# EAGLE schematic dorbell (EAGLE 6.3)
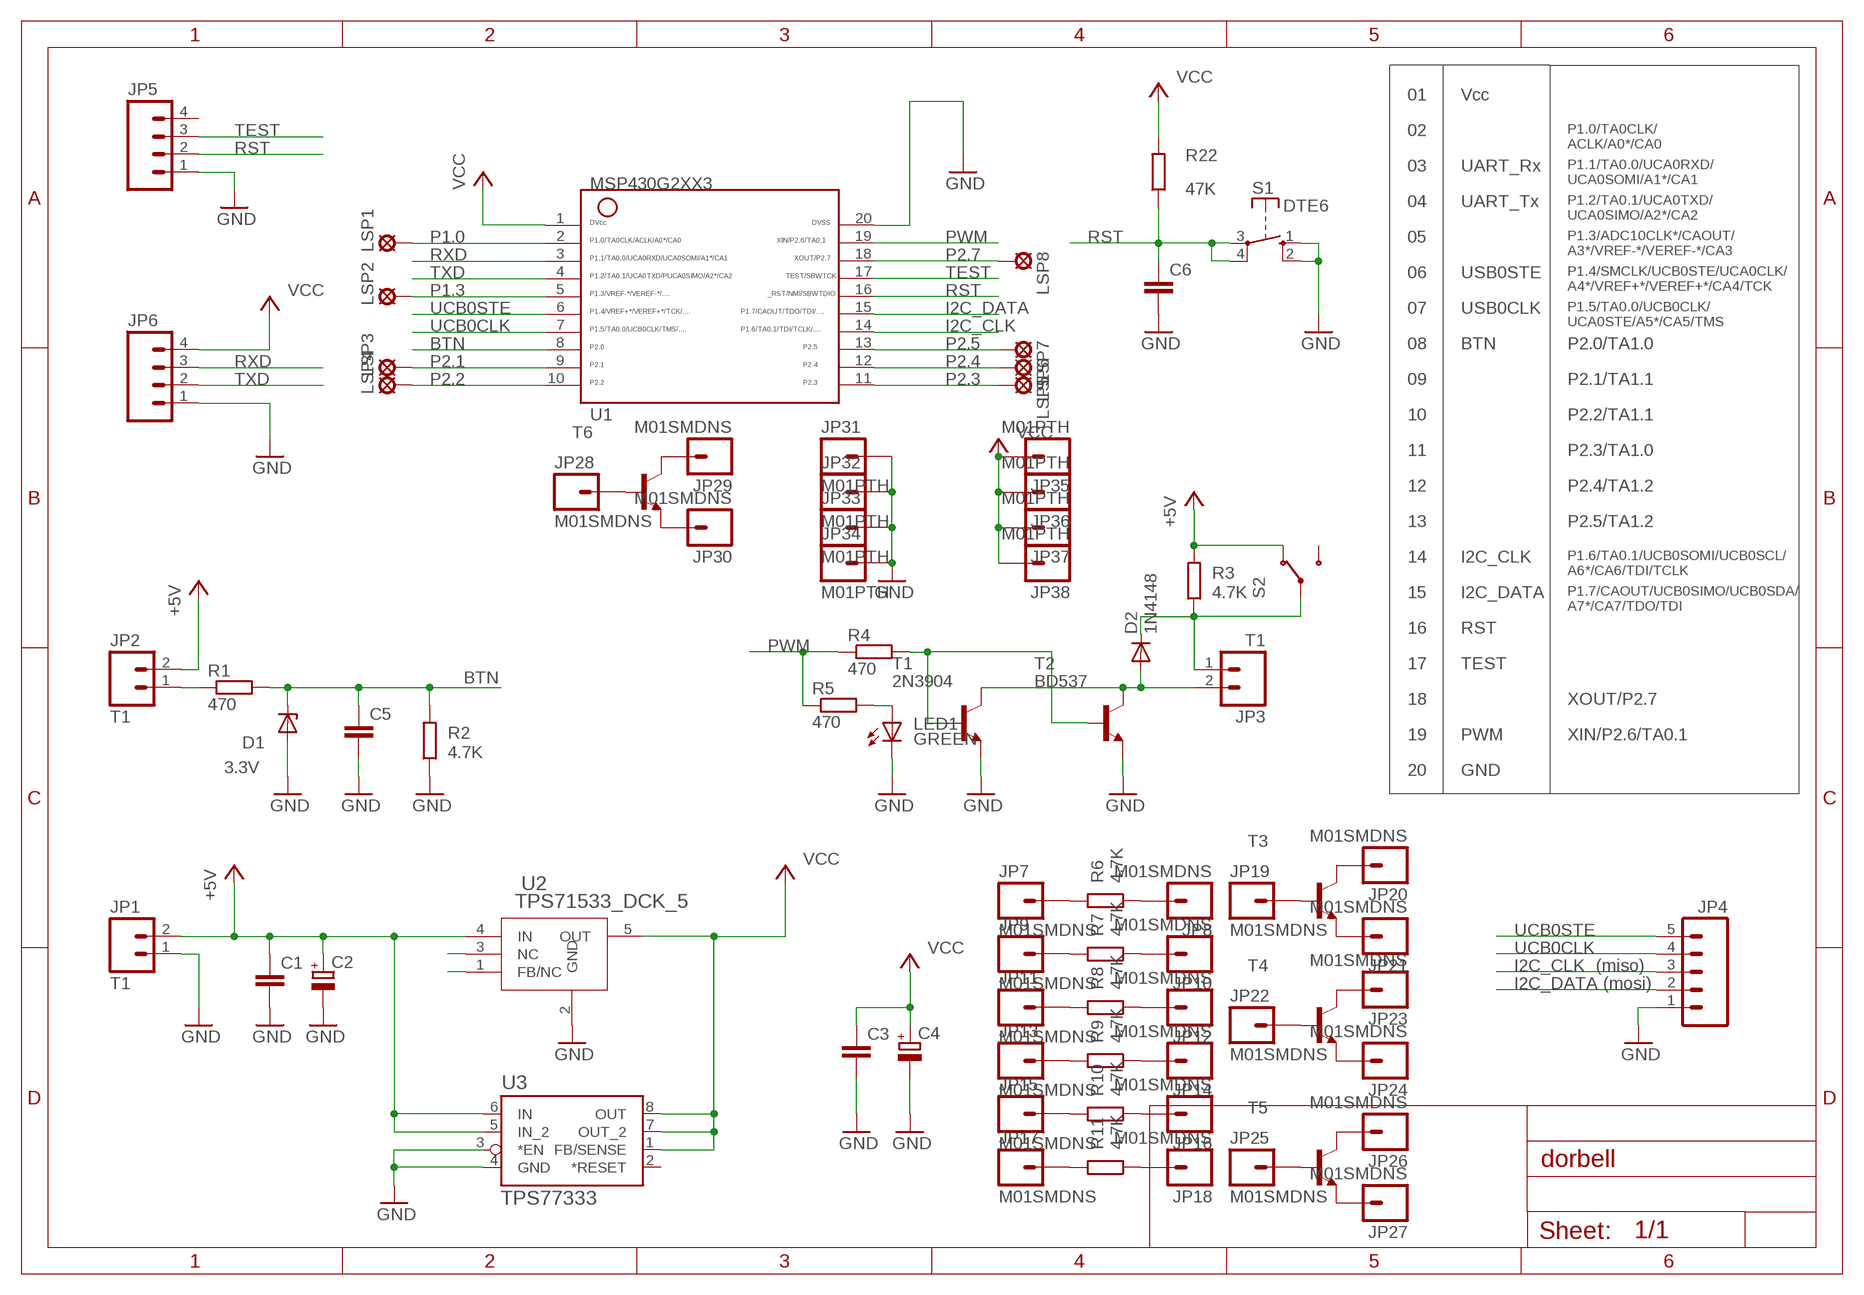
[diagram p0: schematic, sheet 1]

## Parts
C1  C-EUC0805  [C0805]
C2  CPOL-EUE2.5-7  [E2,5-7]
C3  C-EUC0805  [C0805]
C4  CPOL-EUE2.5-7  [E2,5-7]
C5  C-EUC0805  [C0805]
C6  C-EUC0805  [C0805]
D1  3.3V  ZENER-DIODEZD-2.5  [ZDIO-2.5]
D2  1N4148  DIODE-SOD123  [SOD123]
JP1  T1  M025MM  [SCREWTERMINAL-5MM-2]
JP2  T1  M025MM  [SCREWTERMINAL-5MM-2]
JP3  T1  M025MM  [SCREWTERMINAL-5MM-2]
JP4  M05PTH  [1X05]
JP5  M04PTH  [1X04]
JP6  M04PTH  [1X04]
JP7  M01SMDNS  [1X01NS]
JP8  M01SMDNS  [1X01NS]
JP9  M01SMDNS  [1X01NS]
JP10  M01SMDNS  [1X01NS]
JP11  M01SMDNS  [1X01NS]
JP12  M01SMDNS  [1X01NS]
JP13  M01SMDNS  [1X01NS]
JP14  M01SMDNS  [1X01NS]
JP15  M01SMDNS  [1X01NS]
JP16  M01SMDNS  [1X01NS]
JP17  M01SMDNS  [1X01NS]
JP18  M01SMDNS  [1X01NS]
JP19  M01SMDNS  [1X01NS]
JP20  M01SMDNS  [1X01NS]
JP21  M01SMDNS  [1X01NS]
JP22  M01SMDNS  [1X01NS]
JP23  M01SMDNS  [1X01NS]
JP24  M01SMDNS  [1X01NS]
JP25  M01SMDNS  [1X01NS]
JP26  M01SMDNS  [1X01NS]
JP27  M01SMDNS  [1X01NS]
JP28  M01SMDNS  [1X01NS]
JP29  M01SMDNS  [1X01NS]
JP30  M01SMDNS  [1X01NS]
JP31  M01PTH  [1X01]
JP32  M01PTH  [1X01]
JP33  M01PTH  [1X01]
JP34  M01PTH  [1X01]
JP35  M01PTH  [1X01]
JP36  M01PTH  [1X01]
JP37  M01PTH  [1X01]
JP38  M01PTH  [1X01]
LED1  GREEN  LEDCHIP-LED0805  [CHIP-LED0805]
LSP1  LSP10  [LSP10]
LSP2  LSP10  [LSP10]
LSP3  LSP10  [LSP10]
LSP4  LSP10  [LSP10]
LSP5  LSP10  [LSP10]
LSP6  LSP10  [LSP10]
LSP7  LSP10  [LSP10]
LSP8  LSP10  [LSP10]
R1  470  R-EU_R0805  [R0805]
R2  4.7K  R-EU_R0805  [R0805]
R3  4.7K  R-EU_0207/2V  [0207/2V]
R4  470  R-EU_R0805  [R0805]
R5  470  R-EU_R0805  [R0805]
R6  4.7K  R-EU_R0805  [R0805]
R7  4.7K  R-EU_R0805  [R0805]
R8  4.7K  R-EU_R0805  [R0805]
R9  4.7K  R-EU_R0805  [R0805]
R10  4.7K  R-EU_R0805  [R0805]
R11  4.7K  R-EU_R0805  [R0805]
R22  47K  R-EU_R0805  [R0805]
S1  DTE6  [DTE6]
S2  SWITCH_2DIR  [SWITCH_SLIDE]
T1  2N3904  [TO92]
T2  BD537  -NPN-TO220V  [TO220V]
T3  MMBT3904LT1-NPN-SOT23-BEC  [SOT23-BEC]
T4  MMBT3904LT1-NPN-SOT23-BEC  [SOT23-BEC]
T5  MMBT3904LT1-NPN-SOT23-BEC  [SOT23-BEC]
T6  -NPN-TO92-E1  [TO92-E1]
U1  G2XX3---PW20  [PW20]
U2  TPS71533_DCK_5  [DCK5]
U3  TPS77333  [DGK8]

## Nets
+5V [5V]: C1.1 C2.+ JP1.2 JP2.2 R3.2 S2.P$1 U2.4(IN) U3.5(IN_2) U3.6(IN)
BTN: C5.1 D1.C R1.2 R2.2 U1.8
GND [GND]: C1.2 C2.- C3.2 C4.- C5.2 C6.2 D1.A JP1.1 JP4.1 JP5.1 JP6.1 JP31.1 JP32.1 JP33.1 JP34.1 LED1.C R2.1 S1.1(S) S1.2(S) T1.3(E) T2.3(E) U1.20 U2.2(GND) U3.3(*EN) U3.4(GND)
I2C_CLK: JP4.3 U1.14
I2C_DATA: JP4.2 U1.15
N$1: D2.A JP3.2 T1.1(C) T2.2(C)
N$2: D2.C JP3.1 R3.1 S2.P$2
N$3: R4.2 T1.2(B) T2.1(B)
N$4: JP2.1 R1.1
N$5: LED1.A R5.2
N$8: JP7.1 R6.2
N$9: JP8.1 R6.1
N$10: JP9.1 R7.2
N$11: JP10.1 R7.1
N$12: JP11.1 R8.2
N$13: JP12.1 R8.1
N$14: JP13.1 R9.2
N$15: JP14.1 R9.1
N$16: JP15.1 R10.2
N$17: JP16.1 R10.1
N$18: JP17.1 R11.2
N$19: JP18.1 R11.1
N$20: JP19.1 T3.B
N$21: JP20.1 T3.C
N$22: JP21.1 T3.E
N$23: JP22.1 T4.B
N$24: JP23.1 T4.C
N$25: JP24.1 T4.E
N$26: JP25.1 T5.B
N$27: JP26.1 T5.C
N$28: JP27.1 T5.E
N$29: JP28.1 T6.2(B)
N$30: JP29.1 T6.1(C)
N$31: JP30.1 T6.3(E)
N$32: U2.3(NC)
N$33: U2.1(FB/NC)
P1.0: LSP1.MP U1.2
P1.3: LSP2.MP U1.5
P2.1: LSP3.MP U1.9
P2.2: LSP4.MP U1.10
P2.3: LSP5.MP U1.11
P2.4: LSP6.MP U1.12
P2.5: LSP7.MP U1.13
P2.7: LSP8.MP U1.18
PWM: R4.1 R5.1 U1.19
RST: C6.1 JP5.2 R22.1 S1.3(P) S1.4(P) U1.16
RXD: JP6.3 U1.3
TEST: JP5.3 U1.17
TXD: JP6.2 U1.4
UCB0CLK: JP4.4 U1.7
UCB0STE: JP4.5 U1.6
VCC: C3.1 C4.+ JP6.4 JP35.1 JP36.1 JP37.1 JP38.1 R22.2 U1.1 U2.5(OUT) U3.1(FB/SENSE) U3.7(OUT_2) U3.8(OUT)
Unconnected: JP5.4 S2.P$3 U3.2(*RESET)

## Notes on the sheet
- 01 | Vcc
- 02
- P1.0/TA0CLK/
  ACLK/A0*/CA0
- 03 | UART_Rx
- P1.1/TA0.0/UCA0RXD/
  UCA0SOMI/A1*/CA1
- 04 | UART_Tx
- P1.2/TA0.1/UCA0TXD/
  UCA0SIMO/A2*/CA2
- 05
- P1.3/ADC10CLK*/CAOUT/
  A3*/VREF-*/VEREF-*/CA3
- 06 | USB0STE
- P1.4/SMCLK/UCB0STE/UCA0CLK/
  A4*/VREF+*/VEREF+*/CA4/TCK
- 07 | USB0CLK
- P1.5/TA0.0/UCB0CLK/
  UCA0STE/A5*/CA5/TMS
- 08 | BTN | P2.0/TA1.0
- 09 | P2.1/TA1.1
- 10 | P2.2/TA1.1
- 11 | P2.3/TA1.0
- 12 | P2.4/TA1.2
- 13 | P2.5/TA1.2
- 14 | I2C_CLK
- P1.6/TA0.1/UCB0SOMI/UCB0SCL/
  A6*/CA6/TDI/TCLK
- 15 | I2C_DATA
- P1.7/CAOUT/UCB0SIMO/UCB0SDA/
  A7*/CA7/TDO/TDI
- 16 | RST
- 17 | TEST
- 18 | XOUT/P2.7
- 19 | PWM | XIN/P2.6/TA0.1
- 20 | GND
- (miso)
- (mosi)

## Library data of the parts
C1 C3 C5 C6 = rcl:C-EU: CAPACITOR, European symbol
C2 C4 = rcl:CPOL-EU: POLARIZED CAPACITOR, European symbol
D1 = diode:ZENER-DIODE: Z-Diode
D2 = diode:DIODE-: DIODE
JP1-JP3 = SparkFun:M02: Header 2 Standard 2-pin 0.1" header. Use with straight break away headers (SKU : PRT-00116), right angle break away headers (PRT-00553), swiss pins (PRT-00743), machine pins (PRT-00117), and female headers (PRT-00115). Molex polarized connector foot print use with SKU : PRT-08233 with associated crimp pins and housings.
JP4 = SparkFun-Connectors:M05: Header 5 Standard 5-pin 0.1" header. Use with straight break away headers (SKU : PRT-00116), right angle break away headers (PRT-00553), swiss pins (PRT-00743), machine pins (PRT-00117), and female headers (PRT-00115). Molex polarized connector foot print use with SKU : PRT-08230 with associated crimp pins and housings.
JP5 JP6 = SparkFun-Connectors:M04: Header 4 Standard 4-pin 0.1" header. Use with straight break away headers (SKU : PRT-00116), right angle break away headers (PRT-00553), swiss pins (PRT-00743), machine pins (PRT-00117), and female headers (PRT-00115). Molex polarized connector foot print use with SKU : PRT-08231 with associated crimp pins and housings. 1MM SMD Version SKU: PRT-10208
JP7-JP30 = SparkFun:M01: Header 1 Standard 1-pin 0.1" header. Use with straight break away headers (SKU : PRT-00116), right angle break away headers (PRT-00553), swiss pins (PRT-00743), machine pins (PRT-00117), and female headers (PRT-00115).
JP31-JP38 = SparkFun-Connectors:M01: Header 1 Standard 1-pin 0.1" header. Use with straight break away headers (SKU : PRT-00116), right angle break away headers (PRT-00553), swiss pins (PRT-00743), machine pins (PRT-00117), and female headers (PRT-00115).
LED1 = jlab:LED: LED OSRAM: - CHIPLED LG R971, LG N971, LY N971, LG Q971, LY Q971, LO R971, LY R971 LH N974, LH R974 LS Q976, LO Q976, LY Q976 LO Q996 - Hyper CHIPLED LW Q18S LB Q993, LB Q99A, LB R99A - SideLED LS A670, LO A670, LY A670, LG A670, LP A670 LB A673, LV A673, LT A673, LW A673 LH A674 LY A675 LS A676, LA A676, LO A676, LY A676, LW A676 LS A679, LY A679, LG A679 - Hyper Micro SIDELED® LS Y876, LA Y876, LO Y876, LY Y876 LT Y87S - SmartLED LW L88C, LW L88S LB L89C, LB L89S, LG L890 LS L89K, LO L89K, LY L89K LS L896, LA L896, LO L896, LY L896 - TOPLED LS T670, LO T670, LY T670, LG T670, LP T670 LSG T670, LSP T670, LSY T670, LOP T670, LYG T670 LG T671, LOG T671, LSG T671 LB T673, LV T673, LT T673, LW T673 LH T674 LS T676, LA T676, LO T676, LY T676, LB T676, LH T676, LSB T676, LW T676 LB T67C, LV T67C, LT T67C, LS T67K, LO T67K, LY T67K, LW E67C LS E67B, LA E67B, LO E67B, LY E67B, LB E67C, LV E67C, LT E67C LW T67C LS T679, LY T679, LG T679 LS T770, LO T770, LY T770, LG T770, LP T770 LB T773, LV T773, LT T773, LW T773 LH T774 LS E675, LA E675, LY E675, LS T675 LS T776, LA T776, LO T776, LY T776, LB T776 LHGB T686 LT T68C, LB T68C - Hyper Mini TOPLED® LB M676 - Mini TOPLED Santana® LG M470 LS M47K, LO M47K, LY M47K Source: http://www.osram.convergy.de LUXEON: - LUMILED® LXK2-PW12-R00, LXK2-PW12-S00, LXK2-PW14-U00, LXK2-PW14-V00 LXK2-PM12-R00, LXK2-PM12-S00, LXK2-PM14-U00 LXK2-PE12-Q00, LXK2-PE12-R00, LXK2-PE12-S00, LXK2-PE14-T00, LXK2-PE14-U00 LXK2-PB12-K00, LXK2-PB12-L00, LXK2-PB12-M00, LXK2-PB14-N00, LXK2-PB14-P00, LXK2-PB14-Q00 LXK2-PR12-L00, LXK2-PR12-M00, LXK2-PR14-Q00, LXK2-PR14-R00 LXK2-PD12-Q00, LXK2-PD12-R00, LXK2-PD12-S00 LXK2-PH12-R00, LXK2-PH12-S00 LXK2-PL12-P00, LXK2-PL12-Q00, LXK2-PL12-R00 Source: www.luxeon.com KINGBRIGHT: KA-3528ASYC Source: www.kingbright.com
LSP1-LSP8 = solpad:LSP10: SOLDER PAD drill 1.0 mm, distributor Buerklin, 12H555
R1-R11 R22 = rcl:R-EU_: RESISTOR, European symbol
S1 = jlab:DT: 5x5 push button
S2 = jlab:SWITCH_2DIR
T1 = transistor:2N3904: NPN TRANSISTOR
T2-T6 = transistor:*-NPN-: NPN Transistror BF959 corrected 2008.03.06
U1 = TI_MSP430_v16:G2XX3---PW20: MSP430G2XX1 TSSOP (PW) 20 Pin Package
U2 = ti_exports:TPS71533_DCK_5; DATASHEETURL: http://www.ti.com/lit/gpn/TPS71533; DESCRIPTION: Single Output LDO, 50mA, Fixed(3.3V), High Input Voltage, Low Quiescent Current; FAMILY_NAME: SINGLE CHANNEL LDO; GENERIC_PART_NUMBER: TPS71533; INDUSTRY_STD_PKG_TYPE: SC70; MANUFACTURER: Texas Instruments; MANUFACTURER_PART_NUMBER: tps71533_dck_5; PACKAGE_DESIGNATOR: DCK; PIN_COUNT: 5; VENDOR: Texas Instruments
U3 = ti_exports:TPS773*

## Net classes
0 default: width 0.254 mm, clearance 0.152 mm
1 5V: width 0.305 mm, clearance 0.152 mm
2 3V: width 0.305 mm, clearance 0.152 mm
3 GND: width 0.305 mm, clearance 0.406 mm